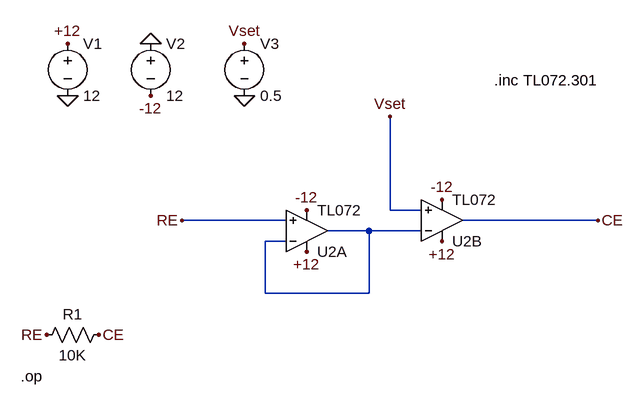
[diagram p0: schematic Control_Loop_DC_OP_PNT_2.asc]
Control_Loop_DC_OP_PNT_2.asc, the LTspice schematic file:
Version 4.1
SHEET 1 880 680
WIRE 352 160 352 16
WIRE 400 160 352 160
WIRE 192 176 32 176
WIRE 672 176 464 176
WIRE 320 192 256 192
WIRE 400 192 320 192
WIRE 192 208 160 208
WIRE 160 288 160 208
WIRE 320 288 320 192
WIRE 320 288 160 288
FLAG -144 -96 +12
FLAG 224 224 +12
FLAG 432 208 +12
FLAG -16 -16 -12
FLAG 128 -96 Vset
FLAG 352 16 Vset
FLAG 224 160 -12
FLAG 432 144 -12
FLAG 128 -16 0
FLAG -16 -96 0
FLAG -144 -16 0
FLAG 32 176 RE
FLAG 672 176 CE
FLAG -176 352 RE
FLAG -96 352 CE
SYMBOL OpAmps\\opamp2 224 256 M180
SYMATTR InstName U2A
SYMATTR Value TL072
SYMBOL OpAmps\\opamp2 432 240 M180
SYMATTR InstName U2B
SYMATTR Value TL072
SYMBOL voltage -144 -112 R0
WINDOW 123 0 0 Left 0
WINDOW 39 0 0 Left 0
SYMATTR InstName V1
SYMATTR Value 12
SYMBOL voltage -16 -112 R0
WINDOW 123 0 0 Left 0
WINDOW 39 0 0 Left 0
SYMATTR InstName V2
SYMATTR Value 12
SYMBOL voltage 128 -112 R0
WINDOW 123 0 0 Left 0
WINDOW 39 0 0 Left 0
SYMATTR InstName V3
SYMATTR Value 0.5
SYMBOL res -80 336 R90
WINDOW 0 0 56 VBottom 2
WINDOW 3 32 56 VTop 2
SYMATTR InstName R1
SYMATTR Value 10K
TEXT 512 -40 Left 2 !.inc TL072.301
TEXT -216 416 Left 2 !.op

The netlist it stands for:
* Control_Loop_DC_OP_PNT_2.asc
X§U2A RE N001 +12 -12 N001 TL072  ; pins In+ In- V+ V- OUT
X§U2B Vset N001 +12 -12 CE TL072  ; pins In+ In- V+ V- OUT
V1 +12 0 12
V2 0 -12 12
V3 Vset 0 0.5
R1 CE RE 10K
.inc TL072.301
.op
.backanno
.end